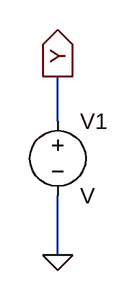
[diagram p0: schematic Draft1.asc]
Draft1.asc, the LTspice schematic file:
Version 4
SHEET 1 880 680
WIRE 144 128 144 80
WIRE 144 272 144 208
FLAG 144 80 Y
IOPIN 144 80 Out
FLAG 144 272 0
SYMBOL voltage 144 112 R0
SYMATTR InstName V1

The netlist it stands for:
* Draft1.asc
V1 Y 0 V
.backanno
.end